# EAGLE design Nintendo 3DS USB-C (EAGLE 6.2)
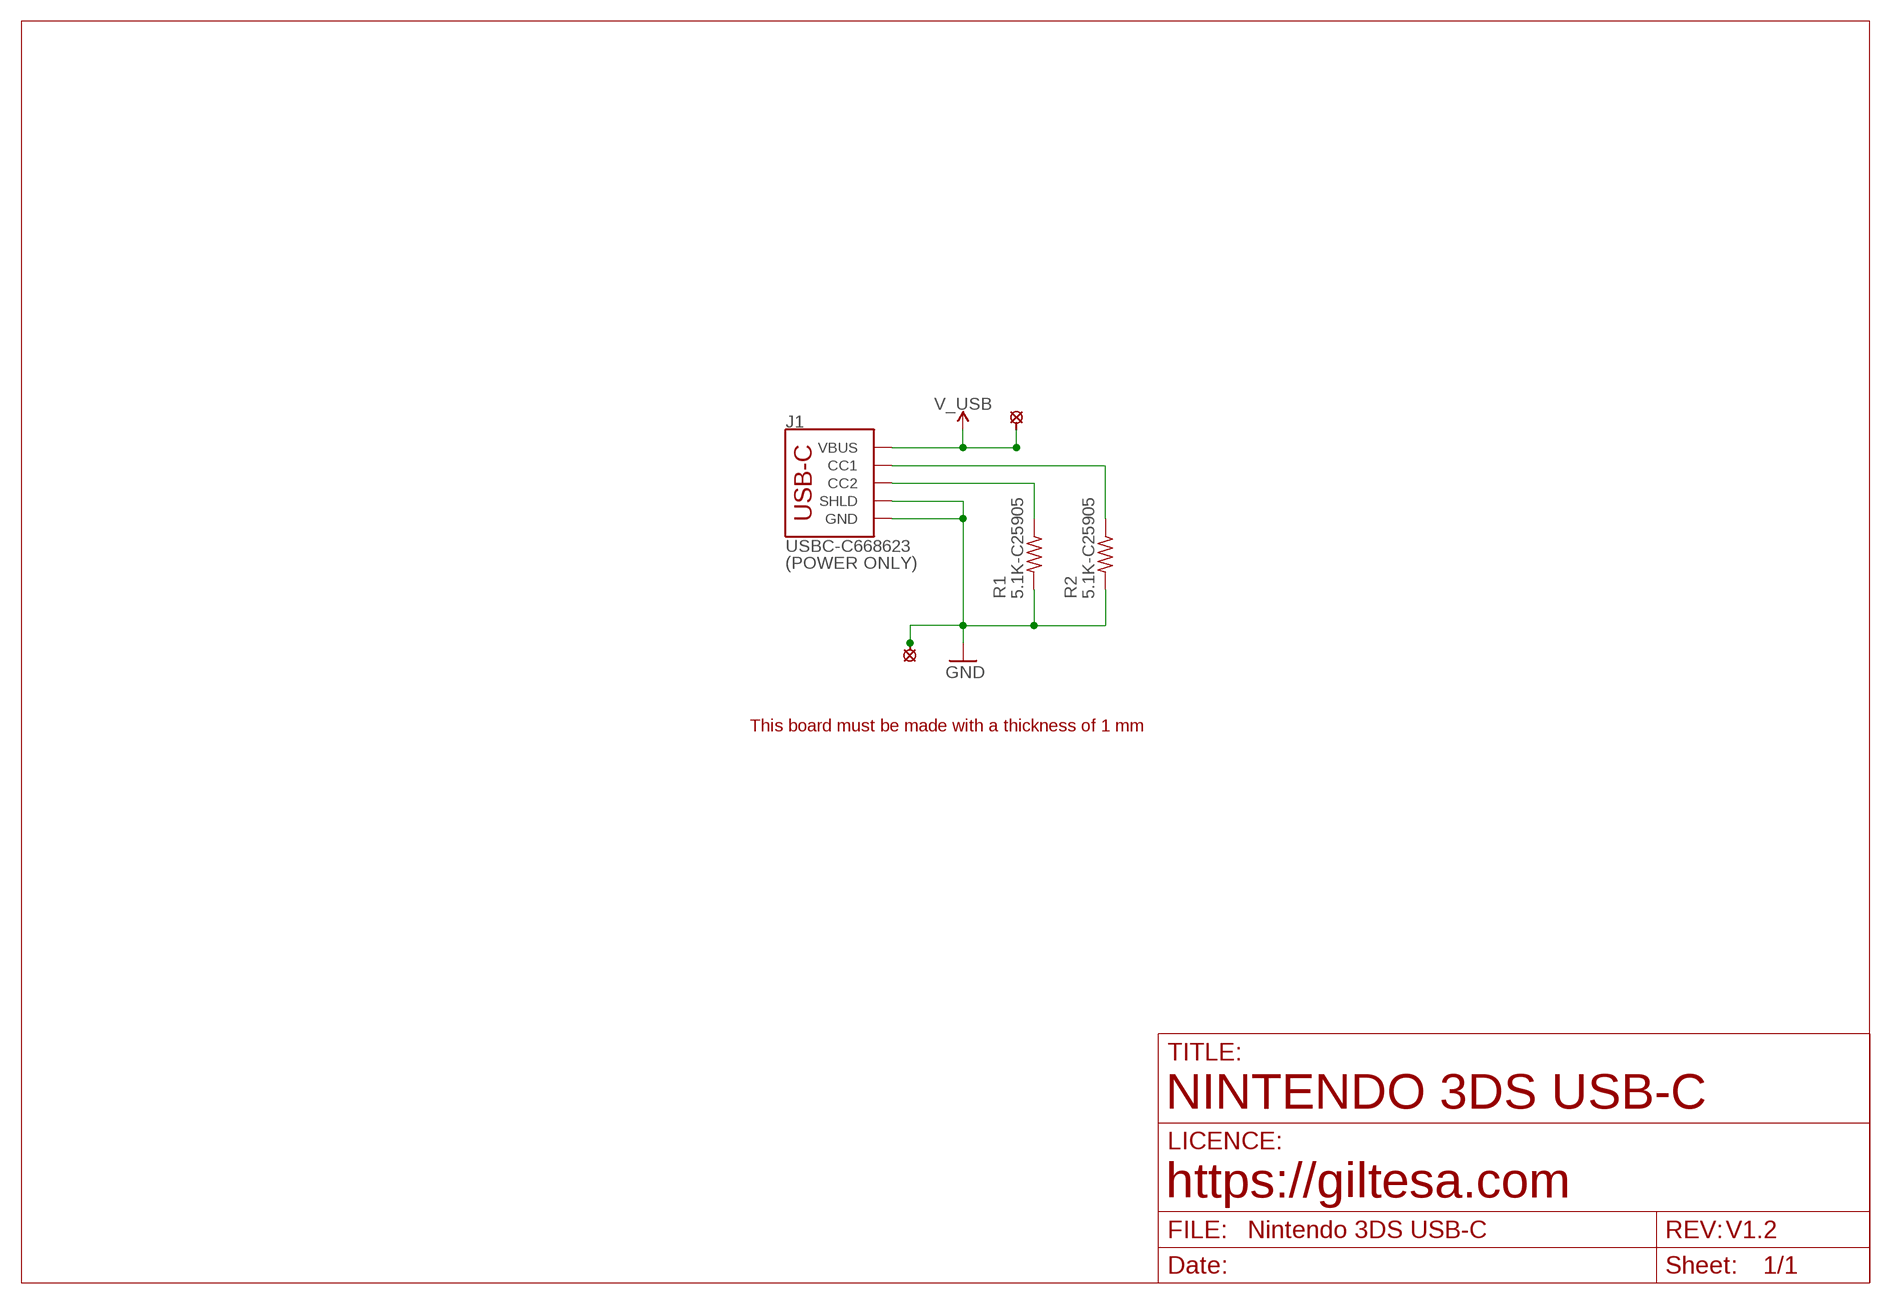
[diagram p0: schematic, sheet 1]

## Parts
J1  USBC-C668623  USB-C_6P_POWER  [USB-C_6P]
R1  5.1K-C25905  R0402  [R0402]
R2  5.1K-C25905  R0402  [R0402]
U$2  PAD_1.0H  [PAD_1.0_HALF_MASK]
U$3  PAD_1.0H  [PAD_1.0_HALF_MASK]
U$4  PAD_1.0H  [PAD_1.0_HALF_MASK]
U$6  PAD_1.0H  [PAD_1.0_HALF_MASK]
U$7  PAD_1.0H  [PAD_1.0_HALF_MASK]
U$8  PAD_1.0H  [PAD_1.0_HALF_MASK]

## Nets
GND: J1.A12-GND(GND) J1.B12-GND(GND) J1.SHLD1(SHLD) J1.SHLD2(SHLD) J1.SHLD3(SHLD) J1.SHLD4(SHLD) R1.2 R2.2 U$4.P$1 U$6.P$1 U$7.P$1 U$8.P$1
N$4: J1.B5(CC2) R1.1
N$13: J1.A5(CC1) R2.1
V_USB: J1.A9-VBUS(VBUS) J1.B9-VBUS(VBUS) U$2.P$1 U$3.P$1

## Notes on the sheet
- (POWER ONLY)
- This board must be made with a thickness of 1 mm
- NINTENDO 3DS USB-C
- https://giltesa.com
- V1.2

## Library data of the parts
J1 = ,giltesa:USB-C_6P
R1 R2 = ,giltesa:R0402
U$2-U$4 U$6-U$8 = ,giltesa:PAD

## Net classes
1 power: width 0.61 mm, drill 0.406 mm, clearance 0.203 mm
2 gnd: width 0.305 mm, drill 0.406 mm, clearance 0.203 mm
3 power usb: width 0.508 mm, drill 0.406 mm, clearance 0.203 mm

## Board
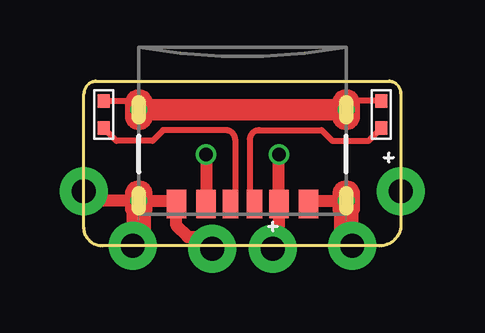
[diagram p1: board, top side]
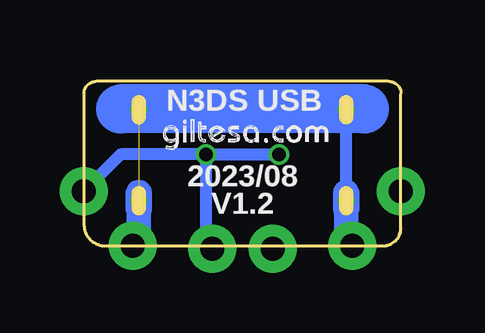
[diagram p2: board, bottom side, seen from below]

Size 13.21 x 6.86 mm. Coordinates in mm from the lower left corner, seen from the top.
Outline: 13.21,6.35 13.21,0.89 arc-90 12.32,0 0.76,0 arc-90 0,0.76 0,6.35 arc-90 0.51,6.86 12.7,6.86 arc-90 13.21,6.35
Copper layers (1*16): Top 0.035mm / dielectric 1.6mm / Bottom 0.035mm
Design rules: minimum track width 6mil, minimum drill 12mil, track to track 6mil, track to pad 6mil, pad to pad 6mil, via to via 8mil, smd to smd 0mil, copper to edge 20mil, drill to drill 10mil, minimum pad ring 6mil, minimum via ring 6mil, stop-mask expansion 0mil, vias tented up to drill 100mil, thermal gap 10mil

### Footprints (pad centres in the part's own frame; a part is rotated, then mirrored left to right if it is on the bottom)
USB-C_6P = smd 0.635 x 1.2: A5 -0.5,2.034; B5 0.5,2.034 | smd 0.8 x 1.2: A9-VBUS 1.52,2.034; A12-GND 2.75,2.034; B9-VBUS -1.52,2.034; B12-GND -2.75,2.034 | drill 0.4 pad 0.6: SHLD1 -4.318,1.9; SHLD2 4.32,1.9; SHLD3 -4.318,-1.9; SHLD4 4.32,-1.9
R0402 = smd 0.559 x 0.5: 1 -0.567,0; 2 0.567,0
PAD_1.0_HALF_MASK = drill 1 pad 2: P$1 0,0

### Placement (x,y rotation side)
J1  6.6,3.78 180 top
R1  0.82,5.48 90 top
R2  12.38,5.48 90 top
U$2  7.87,-0.13 0 top
U$3  13.21,2.29 90 top
U$4  5.33,-0.13 0 top
U$6  0,2.29 270 top
U$7  2.03,0 0 top
U$8  11.18,0 0 top
U$11  [GILTESA.COM_MASK_7MM]  9.96,3.94 0 bottom

### Tracks (layer width: path | path; a pad name or v marks a point on that pad's centre or on a via)
GND  (1 unrouted)
  Top 0.127: J1.B12-GND 9.49,1.88
  Top 0.254: R1.2 2.47,6.04 2.79,5.71 2.32,5.71 J1.SHLD4 | R2.2 11.29,6.04 J1.SHLD3
  Top 0.508: U$4.P$1 4.83,0.38 4.32,0.38 3.85,0.84 J1.A12-GND 3.72,1.88 J1.SHLD2 0.41,1.88 U$6.P$1 | 9.49,1.88 J1.SHLD1
  Top 0.889: J1.SHLD4 J1.SHLD3
  Top 1.016: U$7.P$1 2.28,0.12 J1.SHLD2 | J1.SHLD1 10.92,0.25 U$8.P$1
  Bottom 0.127: J1.SHLD4 1.78,6.1 1.52,5.71 | 11.68,5.71 J1.SHLD3
  Bottom 0.254: 2.16,5.55 J1.SHLD4
  Bottom 0.508: J1.SHLD2 2.28,5.17 2.79,5.68 J1.SHLD4
  Bottom 1.016: U$7.P$1 2.28,0.12 J1.SHLD2 | J1.SHLD1 10.92,0.25 U$8.P$1
  Bottom 2.032: 1.52,5.71 11.68,5.71
N$4
  Top 0.254: J1.B5 6.29,2.25 6.29,4.44 arc90 5.91,4.83 3.3,4.83 2.86,4.38 1.35,4.38 R1.1
N$13
  Top 0.254: R2.1 12.38,4.89 | J1.A5 6.91,1.87 6.91,4.44 arc-90 7.3,4.83 9.91,4.83 10.35,4.38 11.86,4.38 R2.1 | 12.3,4.83 R2.1
V_USB  (via drill 0.56)
  Top 0.508: v5.08,3.81 arc-90 v5.08,3.81 J1.A9-VBUS | v8.12,3.81 J1.B9-VBUS 8.12,0.12 U$2.P$1
  Bottom 0.508: v8.12,3.81 v5.08,3.81 | U$3.P$1 11.68,3.81 v8.12,3.81 | U$2.P$1 8.12,0.12 v8.12,3.81

### Text on the board
bPlace: N3DS USB | 2023/08 | V1.2